# EAGLE design RGBdriverModuleOpAmp_proto (EAGLE 4.16)
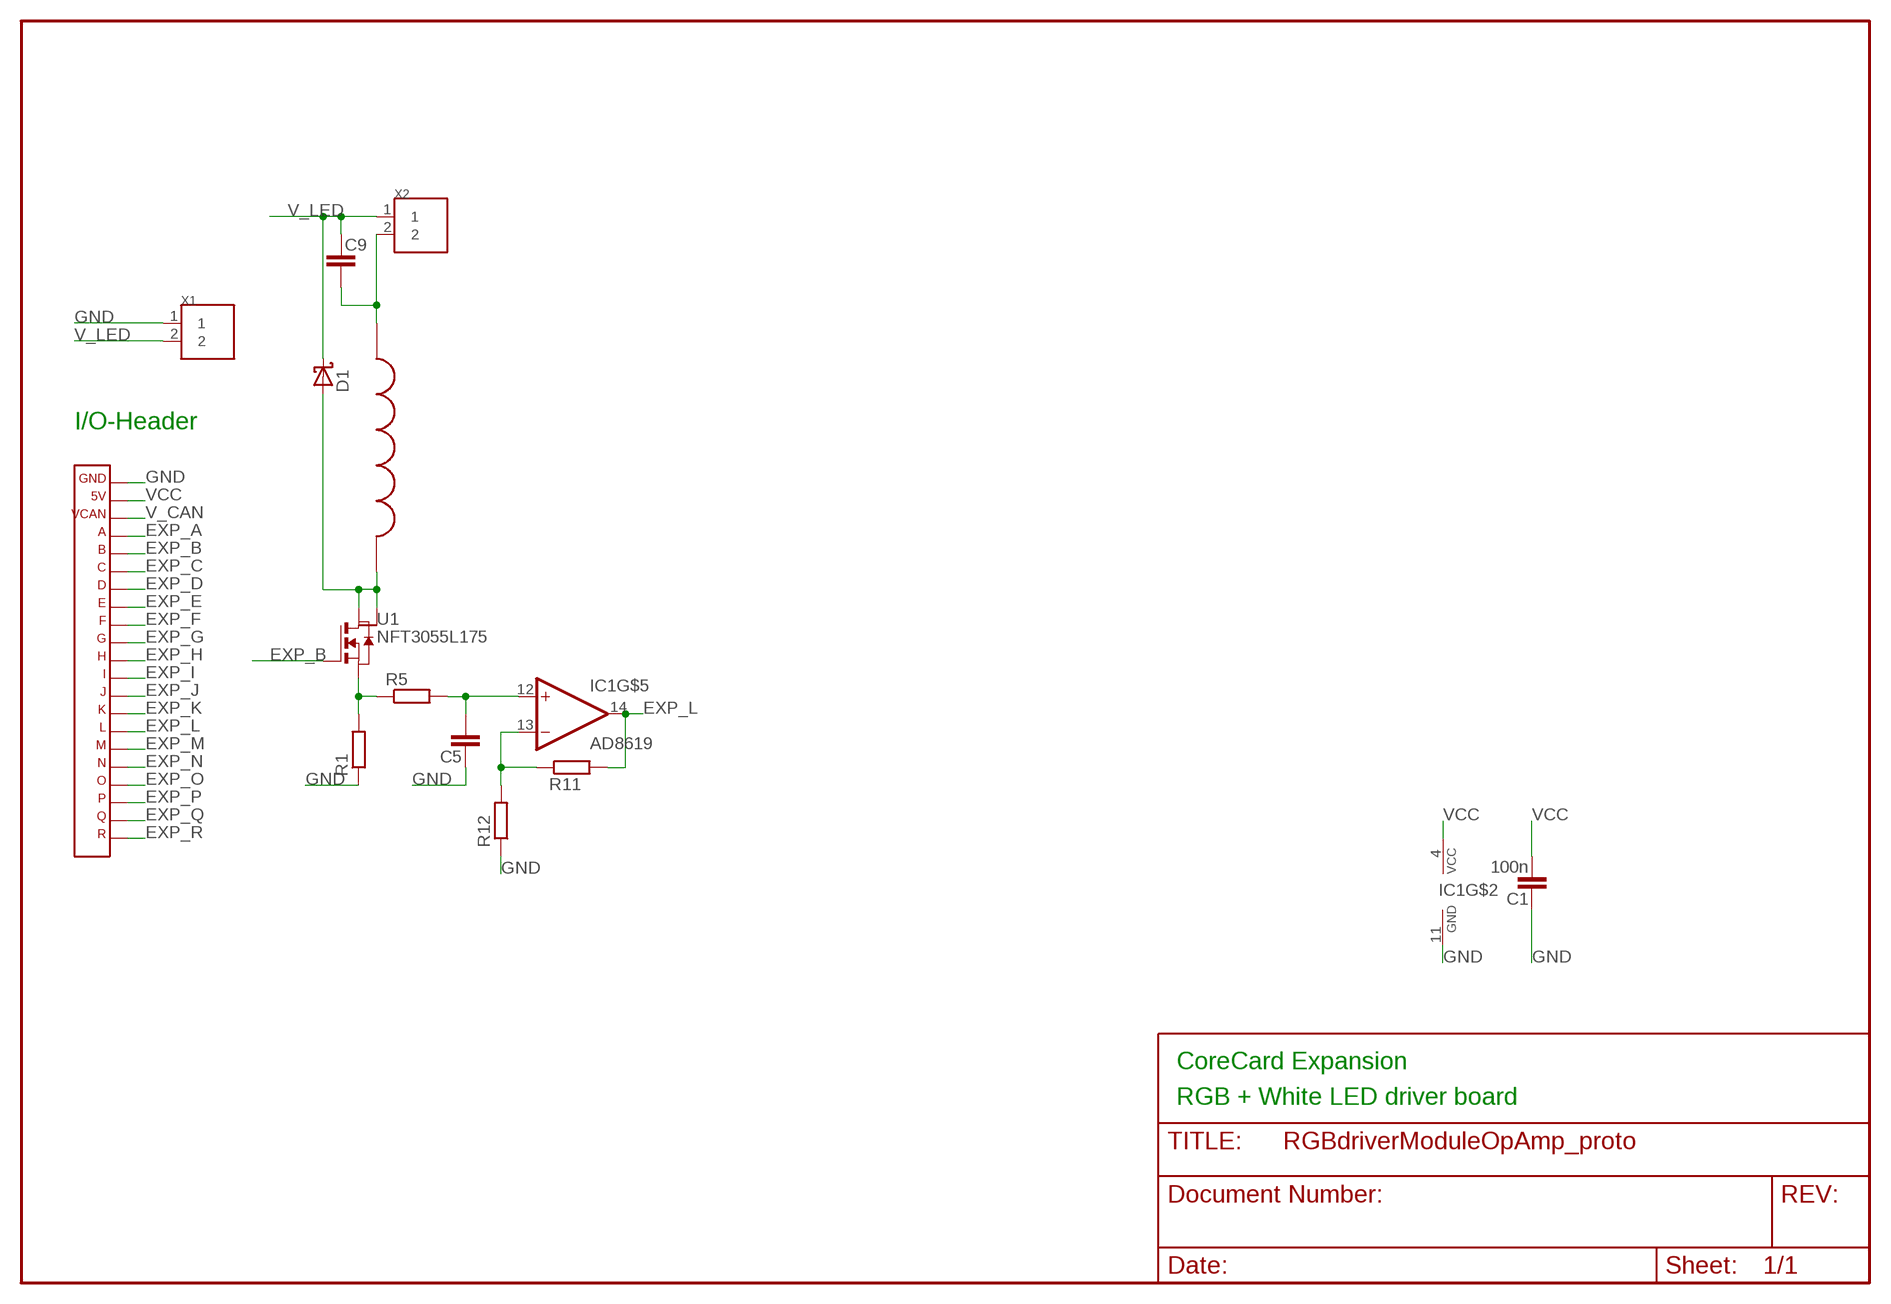
[diagram p0: schematic, sheet 1]

## Parts
C1  100n  C-EUC0603  [C0603]
C5  C-EUC0603  [C0603]
C9  C-EUC1210  [C1210]
D1  SCHOTTKY-DIODESMC  [SMC]
IC1  AD8619  [TSSOP14]
R1  R-EUR0805  [R0805]
R5  R-EUR0603  [R0603]
R11  R-EUR0603  [R0603]
R12  R-EUR0603  [R0603]
U1  NFT3055L175  [SOT223]
U$2  10X10  [10X10]
X1  BLOCK2  [PCB2]
X2  BLOCK2  [PCB2]
X3  CORE_IOHEADEXP  [CORE_IOHEAD_NOSILC]

## Nets
EXP_A: X3.4
EXP_B: U1.1(G) X3.5
EXP_C: X3.6
EXP_D: X3.7
EXP_E: X3.8
EXP_F: X3.9
EXP_G: X3.10
EXP_H: X3.11
EXP_I: X3.12
EXP_J: X3.13
EXP_K: X3.14
EXP_L: IC1.14(OUT) R11.2 X3.15
EXP_M: X3.16
EXP_N: X3.17
EXP_O: X3.18
EXP_P: X3.19
EXP_Q: X3.20
EXP_R: X3.21
GND: C1.1 C5.1 IC1.11(GND) R1.1 R12.1 X1.1 X3.1
L1: D1.A U1.2(D) U1.4(D_PAD) U$2.P$2
N$1: R1.2 R5.1 U1.3(S)
N$5: C9.2 U$2.P$1 X2.2
N$12: C5.2 IC1.12(+IN) R5.2
N$16: IC1.13(-IN) R11.1 R12.2
V_CAN: X3.3
V_LED: C9.1 D1.C X1.2 X2.1
VCC: C1.2 IC1.4(VCC) X3.2
Unconnected: IC1.1(OUT) IC1.2(-IN) IC1.3(+IN) IC1.5(+IN) IC1.6(-IN) IC1.7(OUT) IC1.8(OUT) IC1.9(-IN) IC1.10(+IN)

## Notes on the sheet
- I/O-Header
- CoreCard Expansion
- RGB + White LED driver board

## Library data of the parts
C1 C5 C9 = rcl:C-EU
D1 = diode:SCHOTTKY-DIODE: Schottky Diode
IC1 = ad8619:AD8619
R1 R5 R11 R12 = rcl:R-EU
U1 = NMOS_NTF3055L175:NFT3055L175
U$2 = inductor10x10:10X10
X1 X2 = terminal_block:BLOCK2
X3 = expboard:CORE_IOHEAD: CoreCard IO-header for expansion cards

## Board
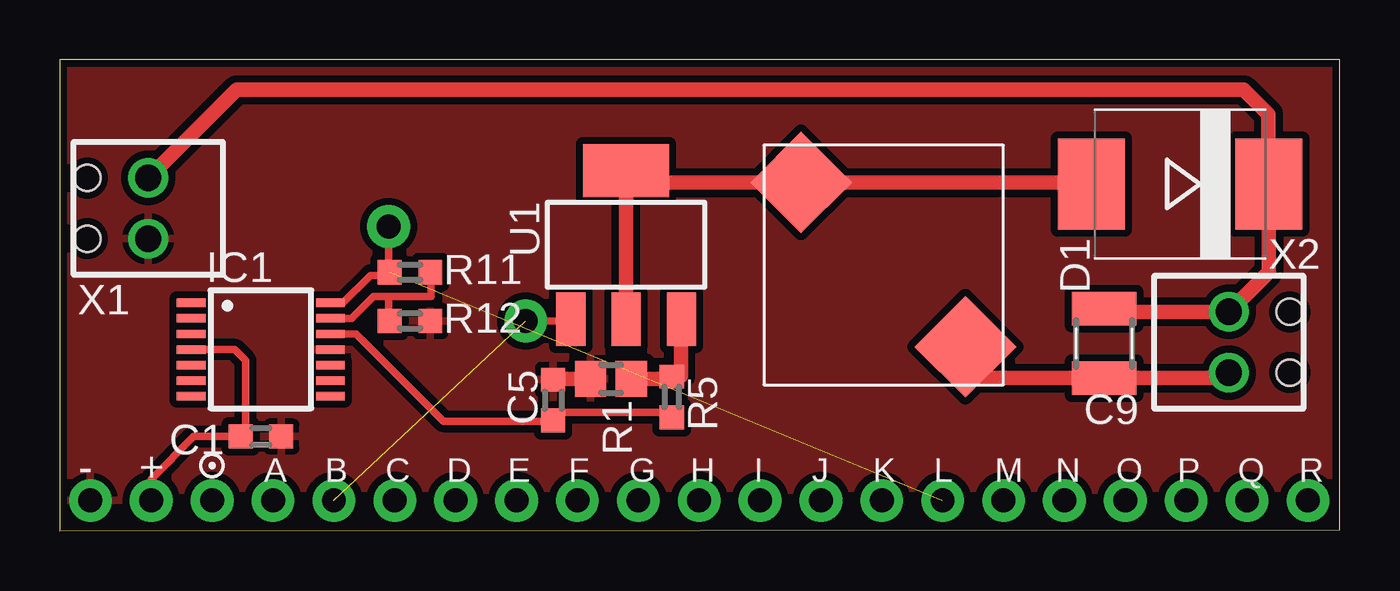
[diagram p1: board, top side]
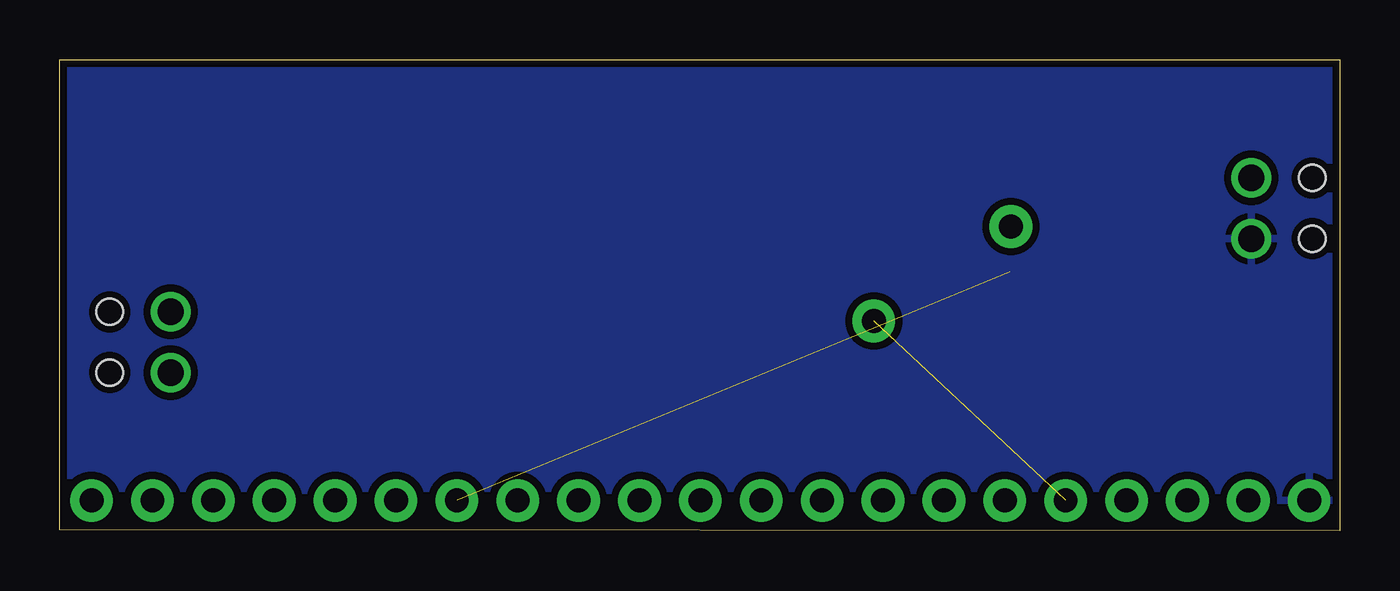
[diagram p2: board, bottom side, seen from below]

Size 53.39 x 19.66 mm. Coordinates in mm from the lower left corner, seen from the top.
Outline: 0,0 53.39,0.05 53.39,19.66 0,19.66 0,0
Copper layers (1*16): Top 0.035mm / dielectric 1.5mm / Bottom 0.035mm
Design rules "default": minimum track width 10mil, minimum drill 0.6mm, track to track 10mil, track to pad 10mil, pad to pad 10mil, via to via 10mil, smd to smd 8mil, copper to edge 10mil, drill to drill 8mil, minimum pad ring 10mil, minimum via ring 10mil, stop-mask expansion 4mil, vias tented up to drill 0mil, thermal gap 10mil

### Footprints (pad centres in the part's own frame; a part is rotated, then mirrored left to right if it is on the bottom)
C0603 = smd 1 x 1: 1 -0.85,0; 2 0.85,0
C1210 = smd 1.4 x 2.7: 1 -1.4,0; 2 1.5,0
SMC = smd 2.8 x 3.8: A 3.7,0; C -3.7,0
TSSOP14 = smd 0.35 x 1.2: 1 -2.025,-2.9; 2 -1.375,-2.9; 3 -0.725,-2.9; 4 -0.075,-2.9; 5 0.575,-2.9; 6 1.225,-2.9; 7 1.875,-2.9; 8 1.875,2.9; 9 1.225,2.9; 10 0.575,2.9; 11 -0.075,2.9; 12 -0.725,2.9; 13 -1.375,2.9; 14 -2.025,2.9
R0805 = smd 1.3 x 1.5: 1 -0.85,0; 2 0.85,0
R0603 = smd 0.991 x 1.016: 1 -0.85,0; 2 0.85,0
SOT223 = smd 1.219 x 2.235: 1 -2.311,-3.099; 2 0,-3.099; 3 2.311,-3.099 | smd 3.6 x 2.2: 4 0,3.099
10X10 = smd 3 x 3 rotated 45: P$1 1.588,1.588; P$2 8.447,8.447
PCB2 = drill 1.1 round: 1 -2.54,0; 2 0,0 | hole 1.1: -2.54,2.54; 0,2.54
CORE_IOHEAD_NOSILC = drill 1 pad 1.778 round: 1 25.4,0; 2 22.86,0; 3 20.32,0; 4 17.78,0; 5 15.24,0; 6 12.7,0; 7 10.16,0; 8 7.62,0; 9 5.08,0; 10 2.54,0; 11 0,0; 12 -2.54,0; 13 -5.08,0; 14 -7.62,0; 15 -10.16,0; 16 -12.7,0; 17 -15.24,0; 18 -17.78,0; 19 -20.32,0; 20 -22.86,0; 21 -25.4,0

### Placement (x,y rotation side)
C1  8.38,3.94 180 top
C5  20.57,5.46 270 top
C9  43.56,7.87 270 top
D1  46.74,14.48 180 top
IC1  8.38,7.49 270 top
R1  22.99,6.35 0 top
R5  25.53,5.59 270 top
R11  14.61,10.79 180 top
R12  14.61,8.76 180 top
U1  23.62,11.94 0 top
U$2  39.37,6.1 90 top
X1  3.68,14.73 90 top
X2  48.77,6.6 270 top
X3  26.67,1.27 0 bottom

### Tracks (layer width: path | path; a pad name or v marks a point on that pad's centre or on a via)
EXP_B  (via drill 1 pad 1.78)  (1 unrouted)
  Top 0.305: U1.1 21.23,8.76 v19.43,8.76
EXP_G
  Bottom 0.305: X3.10 24.13,1.14
EXP_L  (via drill 1 pad 1.78)  (1 unrouted)
  Top 0.305: IC1.14 11.8,9.52 12.95,10.67 13.59,10.67 13.72,10.79 R11.2 13.72,10.83 v13.72,12.7
GND
  Top 0.61: R1.1 20.45,6.35
  pour Bottom (isolate 0.305, rank 3): 0,19.66 53.39,19.66 53.39,1.14 0,1.14
  pour Top (isolate 0.305, rank 3): 0,19.66 53.39,19.66 53.39,1.14 0,1.14
L1
  Top 0.61: U1.2 U1.4 23.75,15.04 23.75,14.54 U$2.P$2 43.05,14.54 43.05,14.48 D1.A
N$1
  Top 0.61: U1.3 25.93,8.79 25.91,8.76 25.91,6.48 R5.1 25.49,6.44 25.4,6.35 R1.2
N$5
  Top 0.61: X2.2 48.9,6.6 48.9,6.37 C9.2 37.85,6.37 37.85,7.68 U$2.P$1
N$12
  Top 0.305: R5.2 25.44,4.74 25.4,4.95 20.57,4.95 | 20.61,4.61 20.57,4.95 | 20.61,4.61 C5.2 20.49,4.61 20.45,4.57 16,4.57 12.36,8.22 IC1.12 | 20.57,4.95 20.45,4.7 20.61,4.61
N$16
  Top 0.305: R11.1 15.46,10.71 15.49,10.67 15.49,9.78 13.72,9.78 | IC1.13 12.17,8.87 13.08,9.78 13.72,9.78 | R12.2 13.72,8.8 13.72,9.78
V_LED
  Top 0.61: 50.42,14.48 50.42,14.86 | C9.1 43.56,9.4 43.81,9.14 X2.1 50.44,10.81 D1.C 50.42,14.48 | X1.2 7.37,18.41 49.4,18.41 50.42,17.4 50.42,14.48
VCC
  Top 0.305: IC1.4 7.29,7.57 7.75,7.11 7.75,4.06 7.62,3.94 C1.2 5.59,3.94 3.81,2.16 X3.2

### Text on the board
tPlace: - | + | A | B | C | D | E | F | G | H | I | J | K | L | M | N | O | P | Q | R
Document: Top is component side | Expansion will be mounted bottom to bottom with CoreCard | Change vertical dimension to fit | Remove I/O-header silcscreen if neccesary | Remove mounting holes if neccesary